# Altium project PocketAnalyzer_R00.PrjPcb
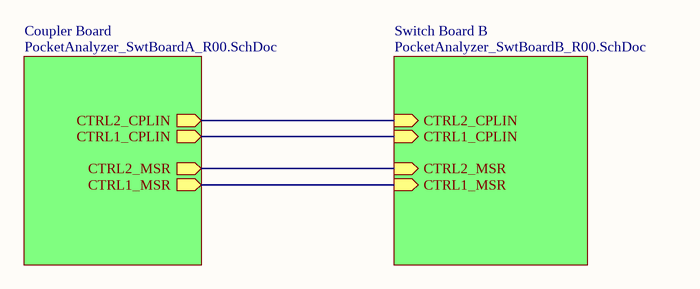
[diagram p0: PocketAnalyzer_BLK_R00.SchDoc]
3 sheets, 36 parts. Net scope: hierarchical (ports join the sheet entries above them; power ports are global).
Board file: PocketAnalyser_R00.PcbDoc
Sheets:
  PocketAnalyzer_BLK_R00.SchDoc
    Coupler Board = PocketAnalyzer_SwtBoardA_R00.SchDoc
    Switch Board B = PocketAnalyzer_SwtBoardB_R00.SchDoc

## Sheet PocketAnalyzer_BLK_R00.SchDoc
size A4; SheetNumber: 1; SheetTotal: 3

### Sub-sheets
Coupler Board = PocketAnalyzer_SwtBoardA_R00.SchDoc: CTRL2_CPLIN (out), CTRL1_CPLIN (out), CTRL2_MSR (out), CTRL1_MSR (out)
Switch Board B = PocketAnalyzer_SwtBoardB_R00.SchDoc: CTRL2_CPLIN (in), CTRL1_CPLIN (in), CTRL2_MSR (in), CTRL1_MSR (in)

### Nets
CTRL1_MSR: sheet Coupler Board/CTRL2_MSR, sheet Switch Board B/CTRL2_MSR
CTRL2_MSR: sheet Coupler Board/CTRL1_MSR, sheet Switch Board B/CTRL1_MSR
NetC17_1: sheet Coupler Board/CTRL2_CPLIN, sheet Switch Board B/CTRL2_CPLIN
NetC19_1: sheet Coupler Board/CTRL1_CPLIN, sheet Switch Board B/CTRL1_CPLIN

## Sheet PocketAnalyzer_SwtBoardA_R00.SchDoc
size A4; SheetNumber: 2; SheetTotal: 3
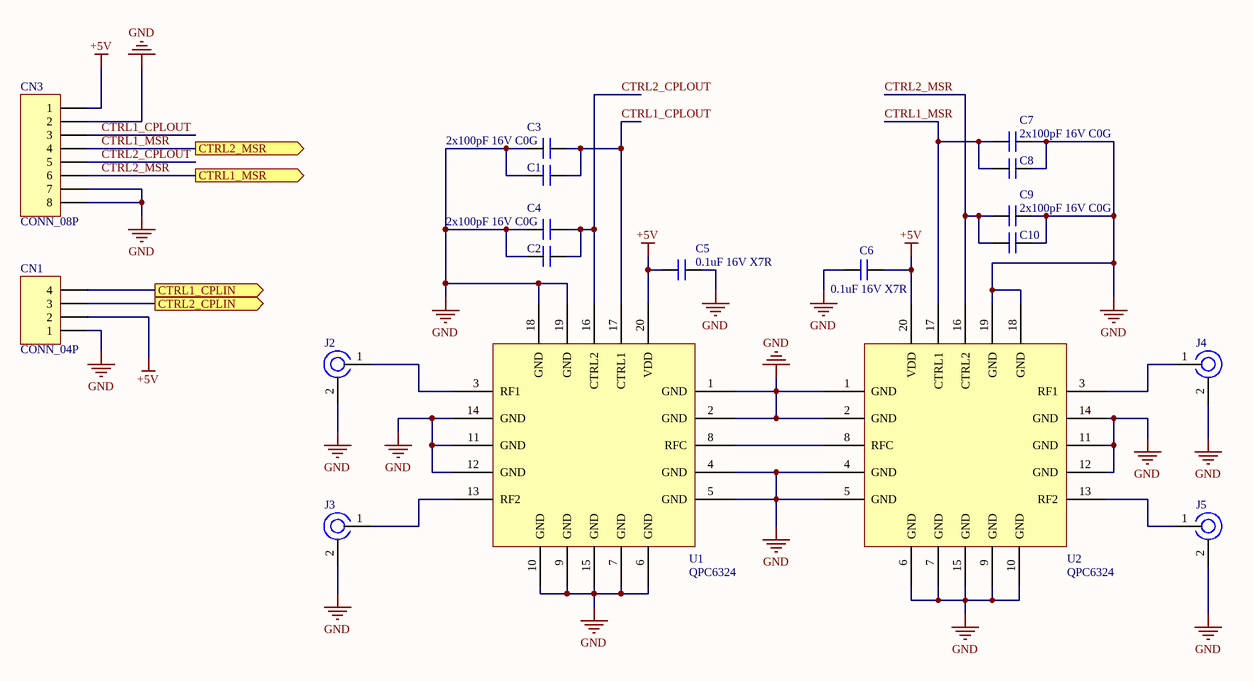
[diagram p1: PocketAnalyzer_SwtBoardA_R00.SchDoc]

### Parts
C1  200pF 16V C0G  [C_0805]  (value not drawn)
C2  2x100pF 16V C0G  [C_0805]  (value not drawn)
C3  2x100pF 16V C0G  [C_0805]
C4  2x100pF 16V C0G  [C_0805]
C5  0.1uF 16V X7R  [C_0805]
C6  0.1uF 16V X7R  [C_0805]
C7  2x100pF 16V C0G  [C_0805]
C8  2x100pF 16V C0G  [C_0805]  (value not drawn)
C9  2x100pF 16V C0G  [C_0805]
C10  2x100pF 16V C0G  [C_0805]  (value not drawn)
CN1  CONN_04P  [Header_M_2x2_0.1"]
CN3  CONN_08P  [Header_M_2x4_0.1"]
J2  SMA_Connector  [SMA_Connector]  (value not drawn)
J3  SMA_Connector  [SMA_Connector]  (value not drawn)
J4  SMA_Connector  [SMA_Connector]  (value not drawn)
J5  SMA_Connector  [SMA_Connector]  (value not drawn)
U1  QPC6324  [QFN50P400X400X90-21N-D]
U2  QPC6324  [QFN50P400X400X90-21N-D]

### Ports
CTRL1_CPLIN (out, see PocketAnalyzer_BLK_R00[2B], PocketAnalyzer_SwtBoardB_R00[3A]), CTRL1_MSR (out, see PocketAnalyzer_BLK_R00[2B], PocketAnalyzer_SwtBoardB_R00[2A]), CTRL2_CPLIN (out, see PocketAnalyzer_BLK_R00[2B], PocketAnalyzer_SwtBoardB_R00[3A]), CTRL2_MSR (out, see PocketAnalyzer_BLK_R00[2B], PocketAnalyzer_SwtBoardB_R00[2A])

### Nets
+5V: C5.1 C6.2 CN1.2 CN3.1 U1.20(VDD) U2.20(VDD)
GND: C1.1 C2.1 C3.1 C4.1 C5.2 C6.1 C7.2 C8.2 C9.2 C10.2 CN1.1 CN3.2 CN3.7 CN3.8 J2.2 J3.2 J4.2 J5.2 U1.1(GND) U1.2(GND) U1.4(GND) U1.5(GND) U1.6(GND) U1.7(GND) U1.9(GND) U1.10(GND) U1.11(GND) U1.12(GND) U1.14(GND) U1.15(GND) U1.18(GND) U1.19(GND) U2.1(GND) U2.2(GND) U2.4(GND) U2.5(GND) U2.6(GND) U2.7(GND) U2.9(GND) U2.10(GND) U2.11(GND) U2.12(GND) U2.14(GND) U2.15(GND) U2.18(GND) U2.19(GND)
CTRL1_CPLOUT: C1.2 C3.2 CN3.3 U1.17(CTRL1)
CTRL1_MSR: C7.1 C8.1 CN3.4 U2.17(CTRL1) ; port CTRL2_MSR
CTRL2_CPLOUT: C2.2 C4.2 CN3.5 U1.16(CTRL2)
CTRL2_MSR: C9.1 C10.1 CN3.6 U2.16(CTRL2) ; port CTRL1_MSR
NetC17_1: CN1.3 ; port CTRL2_CPLIN
NetC19_1: CN1.4 ; port CTRL1_CPLIN
NetJ2_1: J2.1 U1.3(RF1)
NetJ3_1: J3.1 U1.13(RF2)
NetJ4_1: J4.1 U2.3(RF1)
NetJ5_1: J5.1 U2.13(RF2)
NetU1_8: U1.8(RFC) U2.8(RFC)

### Library data of the parts
C1-C10 = Ceramic Cap
CN1 = CONN_04P: Connector Generic 4 Vias
CN3 = CONN_08P: Connector Generic 8 Vias
J2-J5 = SMA_Connector: Connector SMA
U1 U2 = QPC6324: SPDT RF Switch

## Sheet PocketAnalyzer_SwtBoardB_R00.SchDoc
size A4; SheetNumber: 3; SheetTotal: 3
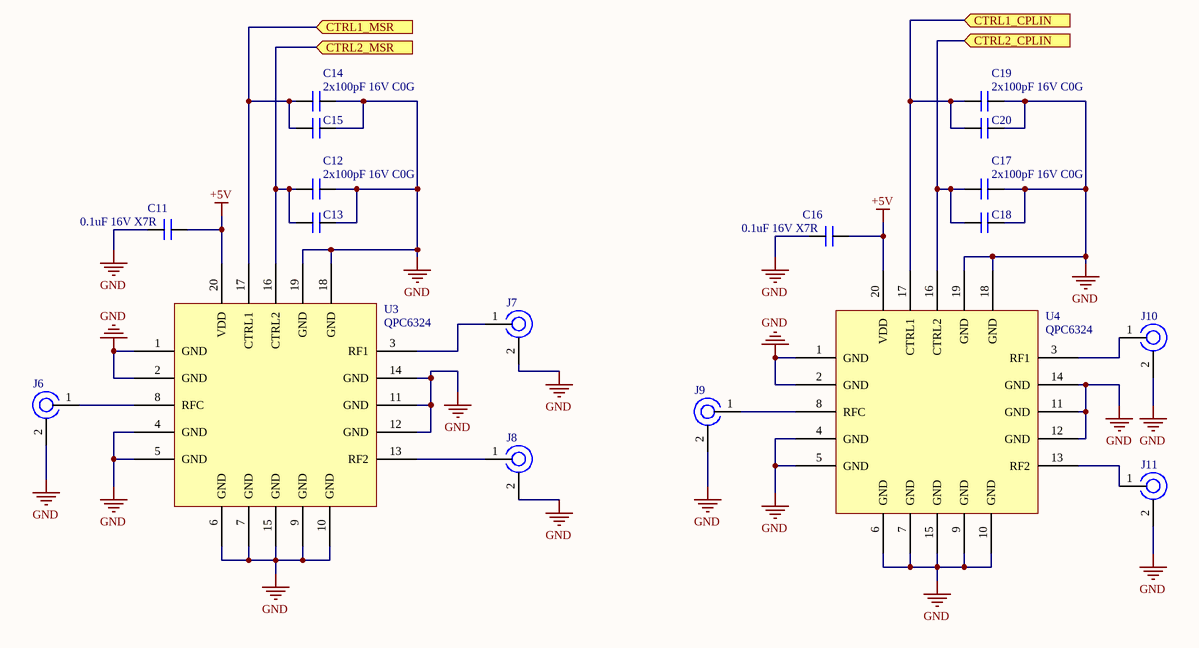
[diagram p2: PocketAnalyzer_SwtBoardB_R00.SchDoc]

### Parts
C11  0.1uF 16V X7R  [C_0805]
C12  2x100pF 16V C0G  [C_0805]
C13  200pF 16V C0G  [C_0805]  (value not drawn)
C14  200pF 16V C0G  [C_0805]  (value not drawn)
C15  2x100pF 16V C0G  [C_0805]
C16  0.1uF 16V X7R  [C_0805]
C17  2x100pF 16V C0G  [C_0805]
C18  200pF 16V C0G  [C_0805]  (value not drawn)
C19  2x100pF 16V C0G  [C_0805]
C20  200pF 16V C0G  [C_0805]  (value not drawn)
J6  SMA_Connector  [SMA_Connector]  (value not drawn)
J7  SMA_Connector  [SMA_Connector]  (value not drawn)
J8  SMA_Connector  [SMA_Connector]  (value not drawn)
J9  SMA_Connector  [SMA_Connector]  (value not drawn)
J10  SMA_Connector  [SMA_Connector]  (value not drawn)
J11  SMA_Connector  [SMA_Connector]  (value not drawn)
U3  QPC6324  [QFN50P400X400X90-21N-D]
U4  QPC6324  [QFN50P400X400X90-21N-D]

### Ports
CTRL1_CPLIN (in), CTRL1_MSR (in), CTRL2_CPLIN (in), CTRL2_MSR (in)

### Nets
+5V: C11.2 C16.2 U3.20(VDD) U4.20(VDD)
GND: C11.1 C12.2 C13.2 C14.2 C15.2 C16.1 C17.2 C18.2 C19.2 C20.2 J6.2 J7.2 J8.2 J9.2 J10.2 J11.2 U3.1(GND) U3.2(GND) U3.4(GND) U3.5(GND) U3.6(GND) U3.7(GND) U3.9(GND) U3.10(GND) U3.11(GND) U3.12(GND) U3.14(GND) U3.15(GND) U3.18(GND) U3.19(GND) U4.1(GND) U4.2(GND) U4.4(GND) U4.5(GND) U4.6(GND) U4.7(GND) U4.9(GND) U4.10(GND) U4.11(GND) U4.12(GND) U4.14(GND) U4.15(GND) U4.18(GND) U4.19(GND)
CTRL1_MSR: C12.1 C13.1 U3.16(CTRL2) ; port CTRL2_MSR
CTRL2_MSR: C14.1 C15.1 U3.17(CTRL1) ; port CTRL1_MSR
NetC17_1: C17.1 C18.1 U4.16(CTRL2) ; port CTRL2_CPLIN
NetC19_1: C19.1 C20.1 U4.17(CTRL1) ; port CTRL1_CPLIN
NetJ6_1: J6.1 U3.8(RFC)
NetJ7_1: J7.1 U3.3(RF1)
NetJ8_1: J8.1 U3.13(RF2)
NetJ9_1: J9.1 U4.8(RFC)
NetJ10_1: J10.1 U4.3(RF1)
NetJ11_1: J11.1 U4.13(RF2)

### Library data of the parts
C11-C20 = Ceramic Cap
J6-J11 = SMA_Connector: Connector SMA
U3 U4 = QPC6324: SPDT RF Switch

## Nets that join several sheets
+5V: PocketAnalyzer_SwtBoardA_R00 (6 pins), PocketAnalyzer_SwtBoardB_R00 (C11.2 C16.2 U3.20 U4.20)
GND: PocketAnalyzer_SwtBoardA_R00 (46 pins), PocketAnalyzer_SwtBoardB_R00 (44 pins)
CTRL1_MSR: PocketAnalyzer_SwtBoardA_R00 (C7.1 C8.1 CN3.4 U2.17), PocketAnalyzer_SwtBoardB_R00 (C12.1 C13.1 U3.16)
CTRL2_MSR: PocketAnalyzer_SwtBoardA_R00 (C9.1 C10.1 CN3.6 U2.16), PocketAnalyzer_SwtBoardB_R00 (C14.1 C15.1 U3.17)
NetC17_1: PocketAnalyzer_SwtBoardA_R00 (CN1.3), PocketAnalyzer_SwtBoardB_R00 (C17.1 C18.1 U4.16)
NetC19_1: PocketAnalyzer_SwtBoardA_R00 (CN1.4), PocketAnalyzer_SwtBoardB_R00 (C19.1 C20.1 U4.17)